# EAGLE design Vario Kobo TOP (EAGLE 6.1)

## Sheet 1 of 2: Alimentation
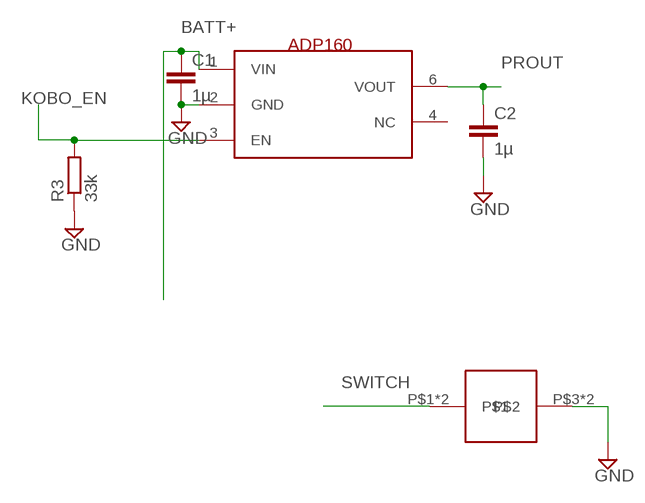
[diagram p0: schematic, sheet 1]

### Parts
ADP160  ADP160/161/162/163  [TSOT23-6_DDC]
BUTTON  LSH_BASE  [LSH_BASE]
C1  1µ  C-EUC0603  [C0603]
C2  1µ  C-EUC0603  [C0603]
R3  33k  R-EU_R0603  [R0603]

### Nets
BATT+: ADP160.1(VIN) C1.1 ; also sheet 2
GND: ADP160.2(GND) BUTTON.P$3 BUTTON.P$4 C1.2 C2.2 R3.1 ; also sheet 2
KOBO_EN: ADP160.3(EN) R3.2 ; also sheet 2
PROUT: ADP160.6(VOUT) C2.1 ; also sheet 2
SWITCH: BUTTON.P$1 BUTTON.P$2 ; also sheet 2
Unconnected: ADP160.4(NC)

## Sheet 2 of 2: Vario Core
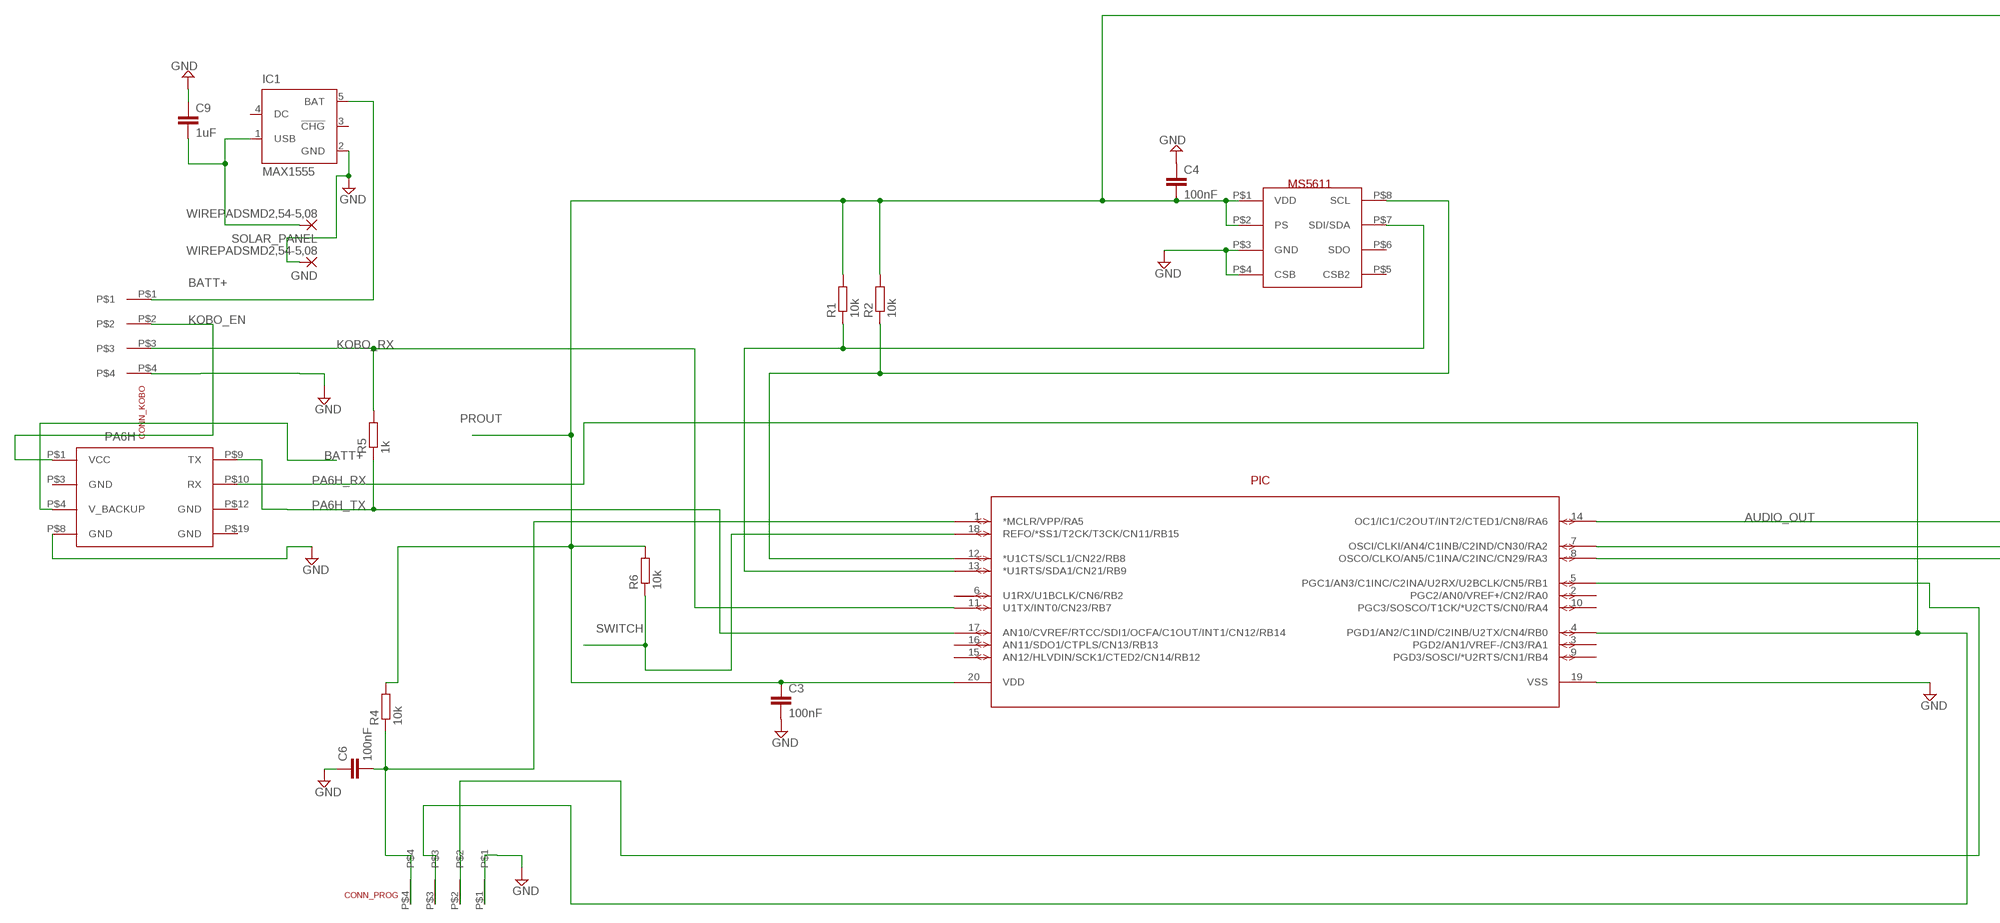
[diagram p1: schematic, sheet 2, part 1 of 2]
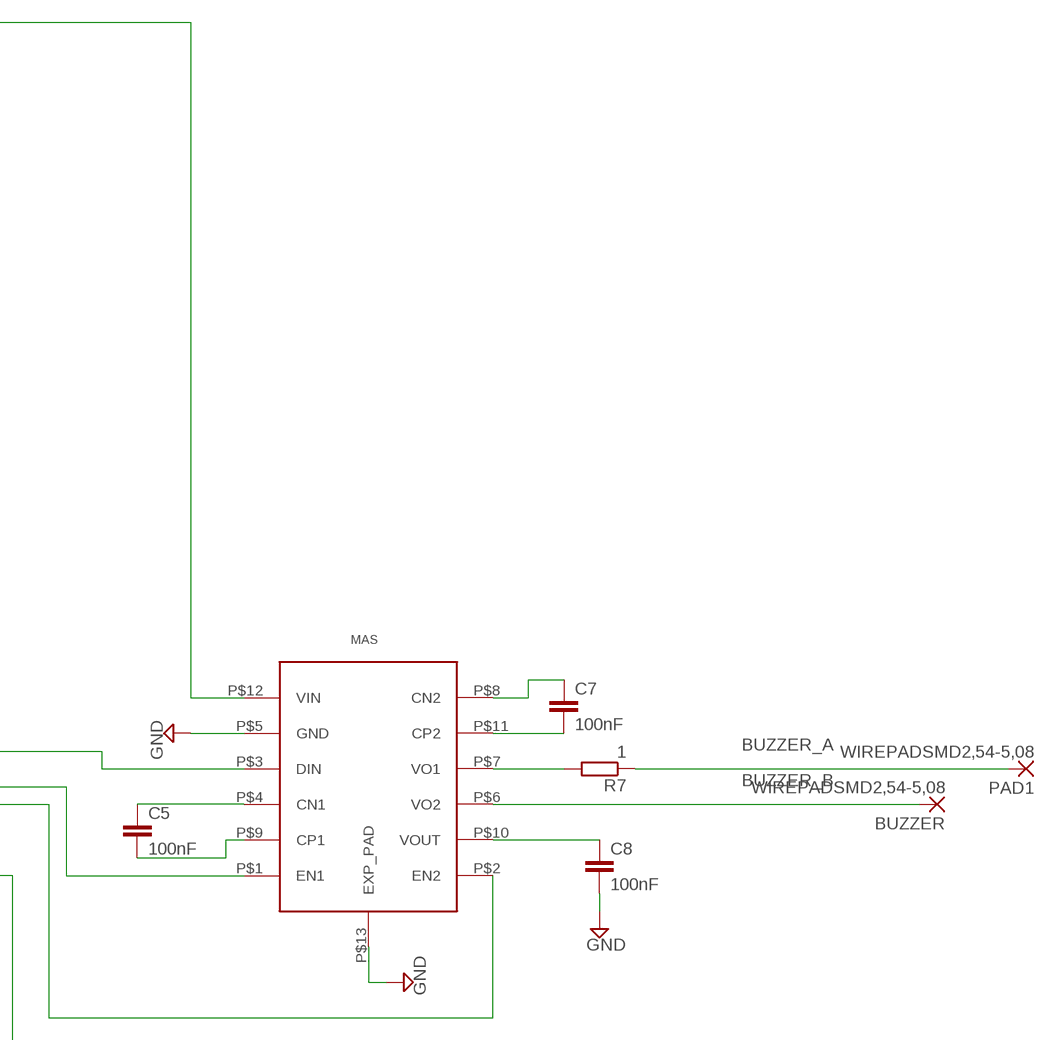
[diagram p2: schematic, sheet 2, part 2 of 2]

### Parts
BUZZER  WIREPADSMD2,54-5,08  [SMD2,54-5,08]
C3  100nF  C-EUC0603  [C0603]
C4  100nF  C-EUC0603  [C0603]
C5  100nF  C-EUC0603  [C0603]
C6  100nF  C-EUC0603  [C0603]
C7  100nF  C-EUC0603  [C0603]
C8  100nF  C-EUC0603  [C0603]
C9  1uF  C-EUC0603  [C0603]
CONN_KOBO  PICO-EZMATE4  [PICO-EZMATE4-PCB]
CONN_PROG  PICO-EZMATE4  [PICO-EZMATE4-PCB]
GND  WIREPADSMD2,54-5,08  [SMD2,54-5,08]
IC1  MAX1555  [SOT23-5L]
MAS  MAS6240  [QFN12_3X3]
MS5611  MS5607PACKAGED  [MS5607-02BA03]
PA6H  PA6H  [PA6H_PRINT]
PAD1  WIREPADSMD2,54-5,08  [SMD2,54-5,08]
PIC  PIC24F16KA101-X_  [SSOP20_MC]
R1  10k  R-EU_R0603  [R0603]
R2  10k  R-EU_R0603  [R0603]
R4  10k  R-EU_R0603  [R0603]
R5  1k  R-EU_R0603  [R0603]
R6  10k  R-EU_R0603  [R0603]
R7  1  R-EU_R0603  [R0603]
SOLAR_PANEL  WIREPADSMD2,54-5,08  [SMD2,54-5,08]

### Nets
AUDIO_OUT: MAS.P$3(DIN) PIC.14(OC1/IC1/C2OUT/INT2/CTED1/CN8/RA6)
BATT+: CONN_KOBO.P$1 IC1.5(BAT) PA6H.P$4(V_BACKUP) ; also sheet 1
BUZZER_A: PAD1.1(P) R7.1
BUZZER_B: BUZZER.1(P) MAS.P$6(VO2)
GND: C3.2 C4.1 C6.1 C8.2 C9.1 CONN_KOBO.P$4 CONN_PROG.P$1 GND.1(P) IC1.2(GND) MAS.P$5(GND) MAS.P$13(EXP_PAD) MS5611.P$3(GND) MS5611.P$4(CSB) PA6H.P$8(GND) PIC.19(VSS) ; also sheet 1
KOBO_EN: CONN_KOBO.P$2 PA6H.P$1(VCC) ; also sheet 1
KOBO_RX: CONN_KOBO.P$3 PIC.11(U1TX/INT0/CN23/RB7) R5.2
MCLR: C6.2 CONN_PROG.P$4 PIC.1(*MCLR/VPP/RA5) R4.1
N$3: C8.1 MAS.P$10(VOUT)
N$4: C5.1 MAS.P$4(CN1)
N$5: C5.2 MAS.P$9(CP1)
N$6: C7.2 MAS.P$11(CP2)
N$7: C7.1 MAS.P$8(CN2)
N$8: MAS.P$7(VO1) R7.2
N$9: MAS.P$1(EN1) PIC.7(OSCI/CLKI/AN4/C1INB/C2IND/CN30/RA2)
N$11: MAS.P$2(EN2) PIC.8(OSCO/CLKO/AN5/C1INA/C2INC/CN29/RA3)
N$13: C9.2 IC1.1(USB) SOLAR_PANEL.1(P)
PA6H_RX: CONN_PROG.P$3 PA6H.P$10(RX) PIC.4(PGD1/AN2/C1IND/C2INB/U2TX/CN4/RB0)
PA6H_TX: PA6H.P$9(TX) PIC.17(AN10/CVREF/RTCC/SDI1/OCFA/C1OUT/INT1/CN12/RB14) R5.1
PGC: CONN_PROG.P$2 PIC.5(PGC1/AN3/C1INC/C2INA/U2RX/U2BCLK/CN5/RB1)
PROUT: C3.1 C4.2 MAS.P$12(VIN) MS5611.P$1(VDD) MS5611.P$2(PS) PIC.20(VDD) R1.2 R2.2 R4.2 R6.2 ; also sheet 1
SCL: MS5611.P$8(SCL) PIC.12(*U1CTS/SCL1/CN22/RB8) R2.1
SDA: MS5611.P$7(SDI/SDA) PIC.13(*U1RTS/SDA1/CN21/RB9) R1.1
SWITCH: PIC.18(REFO/*SS1/T2CK/T3CK/CN11/RB15) R6.1 ; also sheet 1
Unconnected: IC1.3(!CHG) IC1.4(DC) MS5611.P$5(CSB2) MS5611.P$6(SDO) PA6H.P$3(GND) PA6H.P$12(GND) PA6H.P$19(GND) PIC.2(PGC2/AN0/VREF+/CN2/RA0) PIC.3(PGD2/AN1/VREF-/CN3/RA1) PIC.6(U1RX/U1BCLK/CN6/RB2) PIC.9(PGD3/SOSCI/*U2RTS/CN1/RB4) PIC.10(PGC3/SOSCO/T1CK/*U2CTS/CN0/RA4) PIC.15(AN12/HLVDIN/SCK1/CTED2/CN14/RB12) PIC.16(AN11/SDO1/CTPLS/CN13/RB13)

## Library data of the parts
ADP160 = analog-devices:ADP160/161/162/163: LDO, low Iq Linear Voltage Regulator
BUTTON = schurter:LSH_BASE
BUZZER GND PAD1 SOLAR_PANEL = wirepad:WIREPAD: Wire PAD connect wire on PCB
C1-C9 = rcl:C-EU: CAPACITOR, European symbol
CONN_KOBO CONN_PROG = molex:PICO-EZMATE4
IC1 = maxim:MAX1555: Dual-Input USB/AC Adapter 1-Cell Li+ Battery Chargers Source: http://www.maxim-ic.com .. MAX1551-MAX1555.pdf; MF: MAXIM; MPN: MAX1555EZK+T; OC_FARNELL: 1628222; OC_NEWARK: 59J2761
MAS = mas:MAS6240
MS5611 = measurement_specialties:MS5607PACKAGED
PA6H = gtop:PA6H
PIC = microchip:PIC24F16KA101-X_
R1-R7 = rcl:R-EU_: RESISTOR, European symbol

## Board
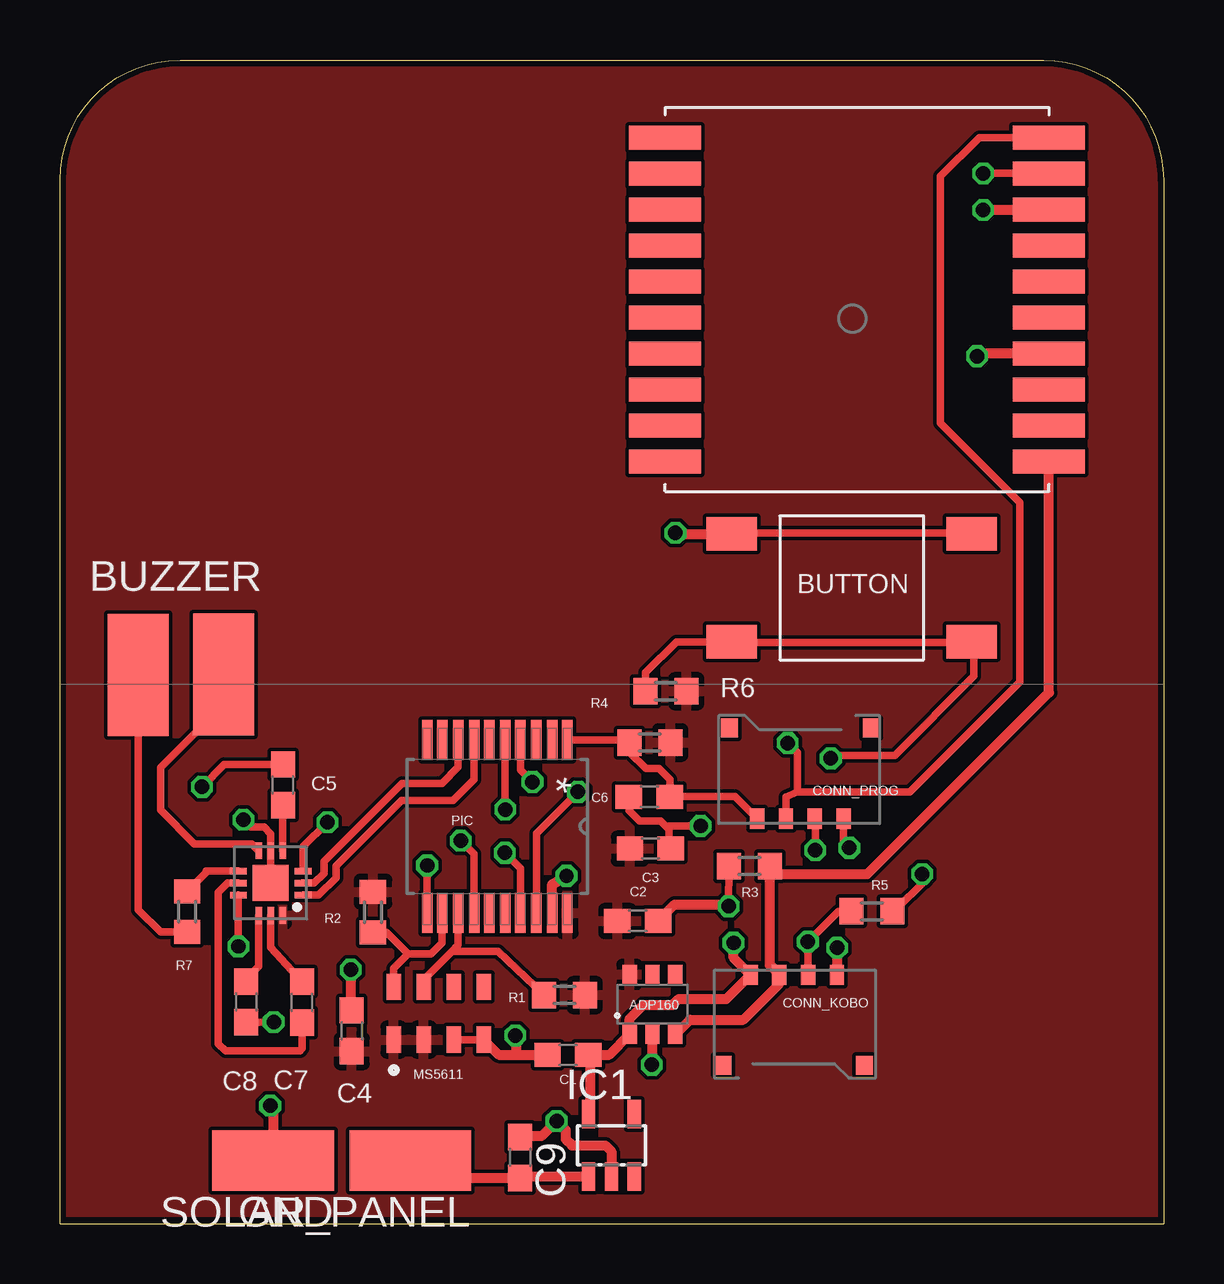
[diagram p3: board, top side]
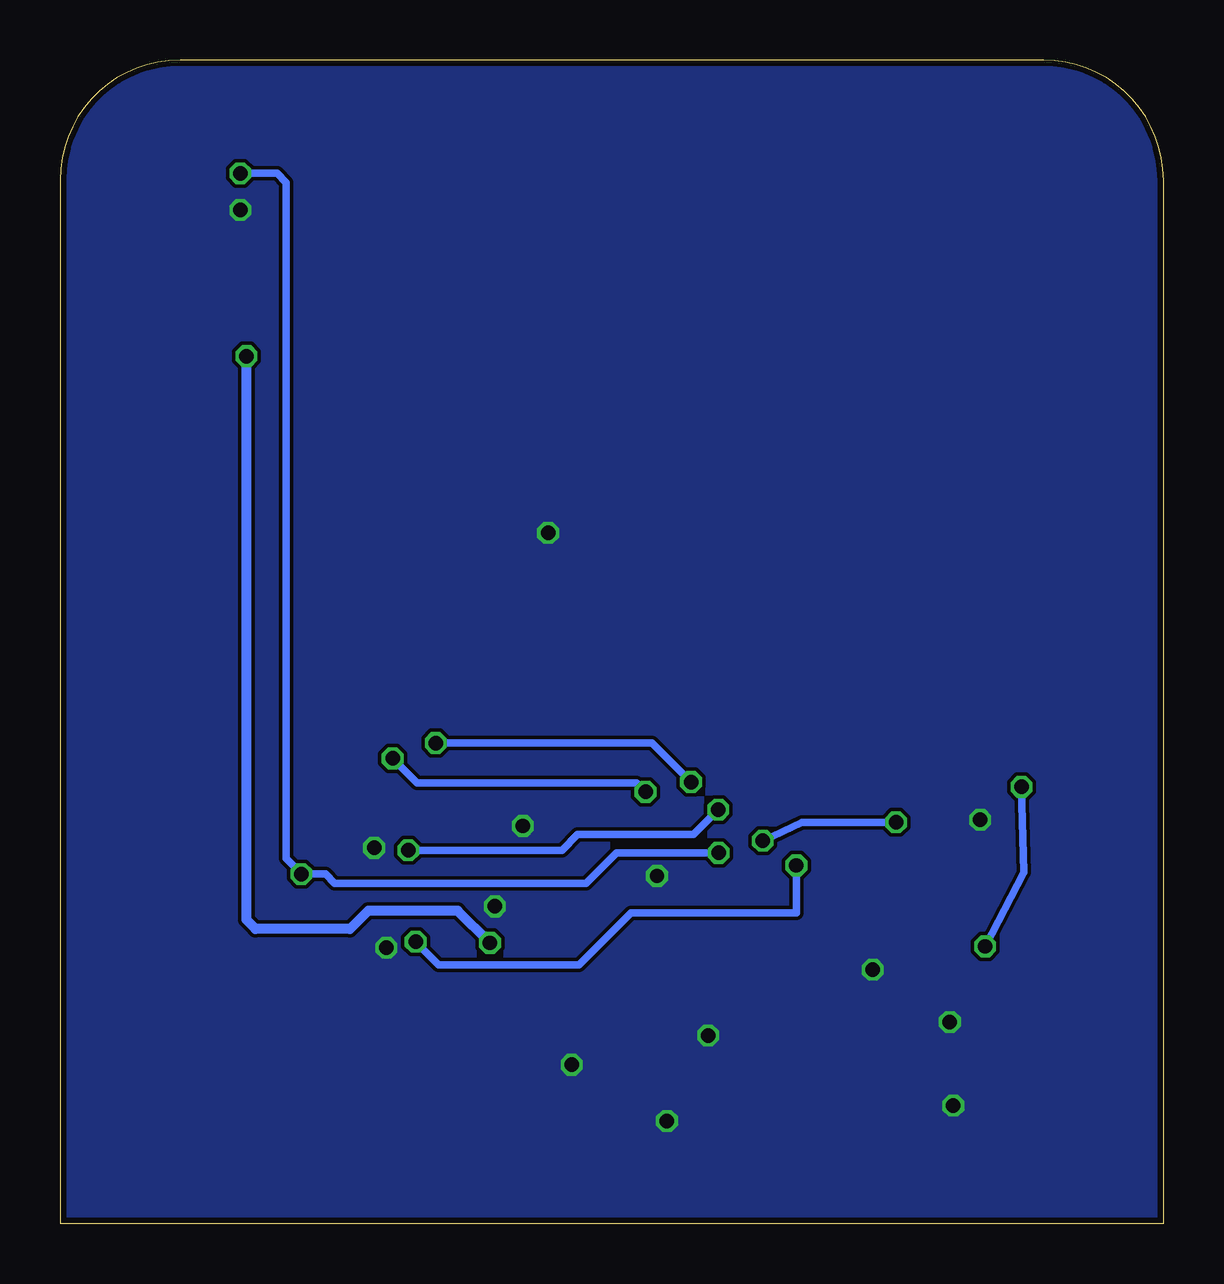
[diagram p4: board, bottom side, seen from below]

Size 46 x 48.5 mm. Coordinates in mm from the lower left corner, seen from the top.
Outline: 0,0 0,43.5 arc-90 5,48.5 41,48.5 arc-90 46,43.5 46,0 0,0
Copper layers (1*16): Top 0.035mm / dielectric 1.5mm / Bottom 0.035mm
Design rules: minimum track width 6mil, minimum drill 12mil, track to track 6mil, track to pad 6mil, pad to pad 6mil, via to via 6mil, smd to smd 0mil, copper to edge 10mil, drill to drill 10mil, minimum pad ring 10mil, minimum via ring 6mil, stop-mask expansion 2mil, vias tented up to drill 100mil, thermal gap 10mil

### Footprints (pad centres in the part's own frame; a part is rotated, then mirrored left to right if it is on the bottom)
TSOT23-6_DDC = smd 0.6 x 0.8: 1 -0.95,-1.25; 2 0,-1.25; 3 0.95,-1.25; 4 0.95,1.25; 5 0,1.25; 6 -0.95,1.25
LSH_BASE = smd 2.1 x 1.4: P$1 -5,2.25; P$2 5,2.25; P$3 5,-2.25; P$4 -5,-2.25
SMD2,54-5,08 = smd 2.54 x 5.08: 1 0,0
C0603 = smd 1.1 x 1: 1 -0.85,0; 2 0.85,0
PICO-EZMATE4-PCB = smd 0.6 x 0.85: P$1 -1.8,0; P$2 -0.6,0; P$3 0.6,0; P$4 1.8,0 | smd 0.7 x 0.8: P$5 2.95,-3.775; P$6 -2.95,-3.775
SOT23-5L = smd 0.55 x 1.2: 1 -0.95,-1.3; 2 0,-1.3; 3 0.95,-1.3; 4 0.95,1.3; 5 -0.95,1.3
QFN12_3X3 = smd 0.28 x 0.7: P$1 -0.5,-1.35; P$2 0,-1.35; P$3 0.5,-1.35; P$7 0.5,1.35; P$8 0,1.35; P$9 -0.5,1.35 | smd 0.7 x 0.28: P$4 1.35,-0.5; P$5 1.35,0; P$6 1.35,0.5; P$10 -1.35,0.5; P$11 -1.35,0; P$12 -1.35,-0.5 | smd 1.5 x 1.5: P$13 0,0
MS5607-02BA03 = smd 1.1 x 0.6: P$1 0,0; P$2 0,-1.25; P$3 0,-2.5; P$4 0,-3.75; P$5 2.2,-3.75; P$6 2.2,-2.5; P$7 2.2,-1.25; P$8 2.2,0
PA6H_PRINT = smd 3 x 1: P$1 -8,6.75; P$2 -8,5.25; P$3 -8,3.75; P$4 -8,2.25; P$5 -8,0.75; P$6 -8,-0.75; P$7 -8,-2.25; P$8 -8,-3.75; P$9 -8,-5.25; P$10 -8,-6.75; P$11 8,-6.75; P$12 8,-5.25; P$13 8,-3.75; P$14 8,-2.25; P$15 8,-0.75; P$16 8,0.75; P$17 8,2.25; P$18 8,3.75; P$19 8,5.25; P$20 8,6.75
SSOP20_MC = smd 1.676 x 0.432: 1 -3.607,2.921; 2 -3.607,2.286; 3 -3.607,1.626; 4 -3.607,0.965; 5 -3.607,0.33; 6 -3.607,-0.33; 7 -3.607,-0.965; 8 -3.607,-1.626; 9 -3.607,-2.286; 10 -3.607,-2.921; 11 3.607,-2.921; 12 3.607,-2.286; 13 3.607,-1.626; 14 3.607,-0.965; 15 3.607,-0.33; 16 3.607,0.33; 17 3.607,0.965; 18 3.607,1.626; 19 3.607,2.286; 20 3.607,2.921
R0603 = smd 1 x 1.1: 1 -0.85,0; 2 0.85,0

### Placement (x,y rotation side)
ADP160  24.7,9.14 0 top
BUTTON  33,26.5 180 top
BUZZER  6.82,22.88 0 top
C1  21.17,7.04 180 top
C2  24.08,12.61 0 top
C3  24.61,15.63 0 top
C4  12.16,8.04 270 top
C5  9.3,18.29 90 top
C6  24.57,17.78 0 top
C7  10.1,9.23 90 top
C8  7.76,9.24 270 top
C9  19.18,2.75 270 top
CONN_KOBO  30.59,10.37 0 top
CONN_PROG  30.86,16.88 180 top
GND  8.89,2.62 90 top
IC1  22.99,3.26 0 top
MAS  8.79,14.19 90 top
MS5611  13.91,7.66 90 top
PA6H  33.23,38.51 180 top
PAD1  3.26,22.86 0 top
PIC  18.23,16.55 270 top
R1  21.03,9.52 0 top
R2  13.05,12.98 90 top
R3  28.74,14.9 0 top
R4  24.59,20.04 0 top
R5  33.84,13.01 180 top
R6  25.25,22.19 0 top
R7  5.3,13 90 top
SOLAR_PANEL  14.61,2.62 90 top

### Tracks (layer width: path | path; a pad name or v marks a point on that pad's centre or on a via)
AUDIO_OUT  (via drill 0.6)
  Top 0.305: MAS.P$3 10.14,15.71 v11.15,16.73 | v16.7,15.96 17.26,15.4 PIC.14
  Bottom 0.305: v16.7,15.96 15.07,16.73 v11.15,16.73
BATT+  (via drill 0.6)
  Top 0.305: 42.43,36.26 PA6H.P$4 41.26,36.26 41.27,36.28
  Top 0.406: v28.08,11.7 28.08,11.07 CONN_KOBO.P$1 27.78,9.36 25.79,9.36 25.54,9.11 24.32,9.11 23.75,8.54 ADP160.1 22.9,7.04 C1.1 22.1,7.04 22.1,4.53 22.07,4.53 IC1.5 | v38.23,36.15 38.35,36.28 41.27,36.28 41.27,36.15
  Bottom 0.406: v28.08,11.7 29.42,13.04 33.15,13.04 33.91,12.28 37.85,12.28 38.23,12.66 v38.23,36.15
BUZZER_A
  Top 0.305: PAD1.1 3.26,13.08 4.19,12.15 R7.1 5.33,12.15
BUZZER_B
  Top 0.305: BUZZER.1 5.8,20.62 4.19,19.01 4.19,17.23 5.59,15.83 7.99,15.83 MAS.P$6
GND  (via drill 0.6)
  Top 0.305: MAS.P$13 MAS.P$5 8.79,16.25 8.51,16.52 7.95,16.52 v7.64,16.83 | MS5611.P$3 MS5611.P$4 | C8.2 8.3,8.39 v8.91,8.4 | R3.1 v27.87,13.22 27.94,13.29 | C6.1 23.72,17.23 24.16,16.78 25.03,16.78 25.38,16.42 | 25.38,16.42 25.38,15.7 C3.2 | v26.7,16.57 25.38,16.57 25.38,16.42 | CONN_PROG.P$1 32.66,15.9 v32.9,15.66 | BUTTON.P$3 28.04,28.79 37.97,28.79 | 38.1,28.79 37.97,28.79 | BUTTON.P$4 37.97,28.78 37.97,28.79
  Top 0.406: PIC.19 20.52,14.14 v21.12,14.49 | ADP160.2 24.67,7.86 v24.67,6.62 | v32.39,11.49 CONN_KOBO.P$4 | v12.12,10.58 12.12,9.43 C4.1 | MS5611.P$4 18.29,7.04 19.03,7.04 | 19.03,7.04 C1.2 | v18.98,7.84 19.03,7.04 | PA6H.P$8 41.21,42.25 v38.48,42.25 | v25.65,28.79 25.69,28.75 BUTTON.P$3 | C2.2 25.61,13.29 27.94,13.29 27.94,13.17 | v8.76,4.91 8.89,4.78 GND.1 | IC1.2 22.99,3.01 22.73,3.26 21.34,3.26 21.08,3.51 21.08,3.89 v20.7,4.28 20.07,3.64 19.3,3.64 | 18.92,3.64 19.18,3.64 | 19.18,3.64 19.3,3.64 | 19.3,3.64 19.3,3.51 | C9.1 19.18,3.64
  pour Bottom: -2,51 -2,-3 49,-3 49,51.5 -2,51.5
KOBO_EN
  Top 0.406: ADP160.3 26.26,8.5 28.48,8.5 29.98,10 CONN_KOBO.P$2 29.59,10.77 R3.2 29.92,14.56 33.66,14.56 41.23,22.13 PA6H.P$1
KOBO_RX  (via drill 0.6)
  Top 0.305: v15.3,14.93 PIC.11 | CONN_KOBO.P$3 31.18,11.74 v31.18,11.75 32.44,13.01 R5.2
  Bottom 0.305: v31.18,11.75 30.21,10.78 24.37,10.78 22.2,12.95 PIC.11 v15.3,14.93
MCLR
  Top 0.305: 21.15,20.57 PIC.1 23.22,20.16 R4.1 23.74,19.64 24.42,18.96 24.98,18.96 25.43,18.5 25.43,17.8 | 25.43,17.8 C6.2 | 25.43,17.8 28.14,17.8 CONN_PROG.P$4
N$3
  Top 0.305: C8.1 7.66,10.09 8.29,10.71 MAS.P$10
N$4
  Top 0.305: C5.1 9.29,17.42 MAS.P$4
N$5  (via drill 0.6)
  Top 0.305: v7.43,11.55 7.44,12.56 MAS.P$9 | C5.2 6.85,19.14 v5.92,18.2
  Bottom 0.305: v5.92,18.2 5.82,14.64 v7.43,11.55
N$6
  Top 0.305: MAS.P$11 8.79,11.51 C7.2
N$7
  Top 0.305: MAS.P$8 6.99,14.19 6.6,13.8 6.6,7.5 6.9,7.2 10,7.2 10.1,7.3 C7.1
N$8
  Top 0.305: MAS.P$7 6.09,14.69 6.09,14.64 R7.2
N$9
  Top 0.305: 17.26,20.18 PIC.7 17.26,18.5 16.39,17.64 14.24,17.64 11.5,14.9 11.5,14.4 10.79,13.69 MAS.P$1
N$11
  Top 0.254: 10.1,14.2 10.13,14.2 MAS.P$2
  Top 0.305: PIC.8 16.6,19.02 15.94,18.35 14.25,18.35 11,15.1 11,14.6 10.6,14.2 10.1,14.2
N$13
  Top 0.406: SOLAR_PANEL.1 15.2,1.9 C9.2 19.23,1.96 IC1.1
PA6H_RX  (via drill 0.6)
  Top 0.305: PIC.4 19.19,18.9 v19.69,18.4 | PA6H.P$10 38.32,45.26 36.7,43.65 36.7,33.36 40.01,30.06 40.01,22.56 35.43,17.99 30.73,17.99 | CONN_PROG.P$3 30.26,17.77 30.73,17.99 | 30.73,17.99 30.73,19.63 v30.34,20.03
  Bottom 0.305: v19.69,18.4 21.32,20.03 v30.34,20.03
PA6H_TX  (via drill 0.6)
  Top 0.305: PIC.17 19.19,14.8 v18.54,15.45 | R5.1 34.85,13.17 34.93,13.17 35.94,14.18 v35.94,14.56 | v38.48,43.77 41.27,43.77 41.27,43.76 PA6H.P$9
  Bottom 0.305: v18.54,15.45 v18.55,15.46 22.79,15.46 24.07,14.18 34.54,14.18 34.92,14.56 v35.94,14.56 35.94,14.58 36.58,15.22 36.58,43.39 36.96,43.77 v38.48,43.77
PGC  (via drill 0.6)
  Top 0.305: CONN_PROG.P$2 31.48,16.88 v31.48,15.56 | v18.56,17.25 PIC.5
  Bottom 0.305: v18.56,17.25 19.59,16.22 24.42,16.22 25.08,15.56 v31.48,15.56
PROUT
  pour Top: 0,48.5 0,0.5 46,0.5 46,48.5
SCL
  Top 0.305: MS5611.P$8 13.91,10.64 14.51,11.24 | 14.51,11.24 15.48,11.24 15.94,11.7 PIC.12 | R2.1 13.62,12.13 14.51,11.24
SDA
  Top 0.305: MS5611.P$7 15.16,10.16 16.34,11.34 | 16.34,11.34 16.6,11.6 PIC.13 | R1.1 18.26,11.34 16.34,11.34
SWITCH  (via drill 0.6)
  Top 0.305: PIC.18 19.86,16.26 v21.59,17.99 | 24.51,21.93 24.38,21.93 24.41,21.95 R6.1 24.41,22.97 25.69,24.25 BUTTON.P$2 28.04,24.21 37.97,24.21 | v32.13,19.39 32.38,19.52 34.8,19.52 38.1,22.82 38.1,24.34 37.97,24.21 | 37.97,24.21 37.97,24.22 BUTTON.P$1
  Bottom 0.305: v21.59,17.99 21.97,18.37 31.11,18.37 v32.13,19.39